# EAGLE design untitled (EAGLE 9.6.1)
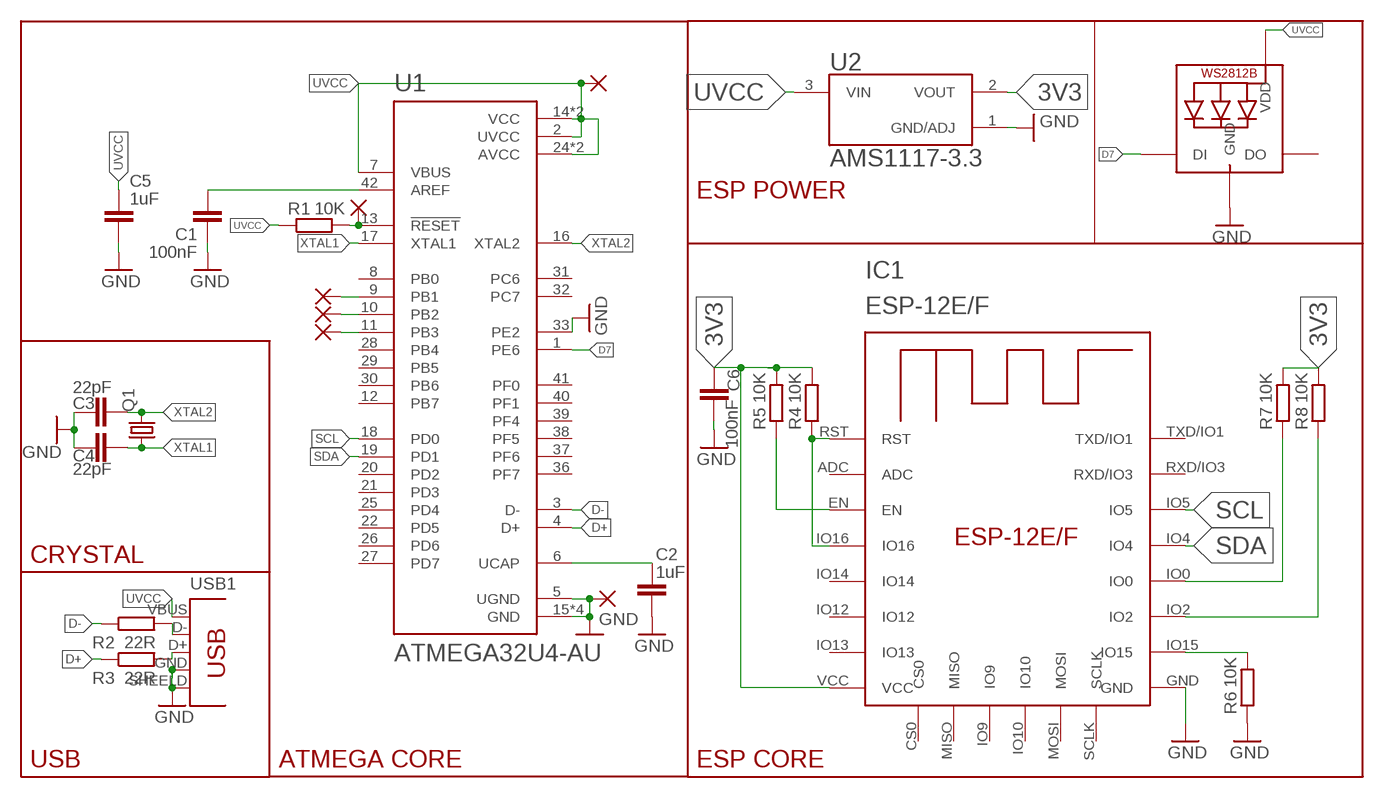
[diagram p0: schematic, sheet 1]

## Parts
C1  100nF  C-EUC0805  [C0805]
C2  1uF  C-EUC0805  [C0805]
C3  22pF  C-EUC0805  [C0805]
C4  22pF  C-EUC0805  [C0805]
C5  1uF  C-EUC0805  [C0805]
C6  100nF  C-EUC0805  [C0805]
IC1  ESP-12E/F  [ESP-12E]
LED1  WS2812B5050  [WS2812B]
PAD1  1,6/0,8  [1,6/0,8]
PAD2  1,6/0,8  [1,6/0,8]
PAD3  1,6/0,8  [1,6/0,8]
PAD4  1,6/0,8  [1,6/0,8]
PAD5  1,6/0,8  [1,6/0,8]
PAD6  1,6/0,8  [1,6/0,8]
Q1  CRYSTALCTS406  [CTS406]
R1  10K  R-EU_R0805  [R0805]
R2  22R  R-EU_R0805  [R0805]
R3  22R  R-EU_R0805  [R0805]
R4  10K  R-EU_R0805  [R0805]
R5  10K  R-EU_R0805  [R0805]
R6  10K  R-EU_R0805  [R0805]
R7  10K  R-EU_R0805  [R0805]
R8  10K  R-EU_R0805  [R0805]
U1  ATMEGA32U4-AU  [QFP80P1200X1200X120-44N]
U2  AMS1117-3.3  [SOT229P700X180-4N]
USB1  TYPE-A-MALE-SHILED  [TYPE-A-MALE]

## Nets
3V3: C6.1 IC1.VCC R4.2 R5.2 R7.2 R8.2 U2.2(VOUT)
D7: LED1.4-DIN(DI) U1.1(PE6)
D+: R3.1 U1.4(D+)
D-: R2.1 U1.3(D-)
GND: C1.1 C2.2 C3.1 C4.1 C5.2 C6.2 IC1.GND LED1.3-GND(GND) PAD6.1(P) R6.1 U1.5(UGND) U1.15(GND) U1.23(GND) U1.33(PE2) U1.35(GND) U1.43(GND) U2.1(GND/ADJ) USB1.GND USB1.SHEELD
MISO: PAD3.1(P) U1.11(PB3)
MOSI: PAD2.1(P) U1.10(PB2)
N$1: R2.2 USB1.D-
N$2: C1.2 U1.42(AREF)
N$3: C2.1 U1.6(UCAP)
N$5: R3.2 USB1.D+
N$6: IC1.IO16 IC1.RST R4.1
N$7: IC1.EN R5.1
N$9: IC1.IO0 R7.1
N$10: IC1.IO2 R8.1
N$12: IC1.IO15 R6.2
RST: PAD4.1(P) R1.2 U1.13(!RESET)
SCK: PAD1.1(P) U1.9(PB1)
SCL: IC1.IO5 U1.18(PD0)
SDA: IC1.IO4 U1.19(PD1)
UVCC: C5.1 LED1.1-VDD(VDD) PAD5.1(P) R1.1 U1.2(UVCC) U1.7(VBUS) U1.14(VCC) U1.24(AVCC) U1.34(VCC) U1.44(AVCC) U2.3(VIN) USB1.VBUS
XTAL1: C4.2 Q1.1 U1.17(XTAL1)
XTAL2: C3.2 Q1.3 U1.16(XTAL2)
Unconnected: IC1.ADC IC1.CS0 IC1.IO9 IC1.IO10 IC1.IO12 IC1.IO13 IC1.IO14 IC1.MISO IC1.MOSI IC1.RXD/IO3 IC1.SCLK IC1.TXD/IO1 LED1.2-DOUT(DO) U1.8(PB0) U1.12(PB7) U1.20(PD2) U1.21(PD3) U1.22(PD5) U1.25(PD4) U1.26(PD6) U1.27(PD7) U1.28(PB4) U1.29(PB5) U1.30(PB6) U1.31(PC6) U1.32(PC7) U1.36(PF7) U1.37(PF6) U1.38(PF5) U1.39(PF4) U1.40(PF1) U1.41(PF0)

## Notes on the sheet
- ESP POWER
- CRYSTAL
- USB | ATMEGA CORE | ESP CORE

## Library data of the parts
C1-C6 = rcl:C-EU: CAPACITOR, European symbol; SPICEPREFIX: C
IC1 = esp-12e-f:ESP-12E/F
LED1 = WS2812B_LED:WS2812B: Check availability <https://pricing.snapeda.com/parts/WS2812B/Worldsemi/view-part?ref=eda>; AVAILABILITY: Not in stock; CHECK_PRICES: https://www.snapeda.com/parts/WS2812B/Worldsemi/view-part/?ref=eda; DESCRIPTION: Intelligent control LED integrated light source; MF: Worldsemi; MP: WS2812B; PACKAGE: None; PRICE: None; SNAPEDA_LINK: https://www.snapeda.com/parts/WS2812B/Worldsemi/view-part/?ref=snap
PAD1-PAD6 = wirepad:1,6/0,8: THROUGH-HOLE PAD
Q1 = crystal:CRYSTAL: CRYSTAL; OC_FARNELL: unknown; OC_NEWARK: unknown
R1-R8 = rcl:R-EU_: RESISTOR, European symbol; SPICEPREFIX: R
U1 = ATMEGA32U4-AU:ATMEGA32U4-AU: ATmega Series 16 MHz 32 KB Flash 2.5 KB SRAM 8-Bit Microcontroller - TQFP-44 Check availability <https://pricing.snapeda.com/parts/ATMEGA32U4-AU/Microchip/view-part?ref=eda>; AVAILABILITY: In Stock; CHECK_PRICES: https://www.snapeda.com/parts/ATMEGA32U4-AU/Microchip/view-part/?ref=eda; DESCRIPTION: Microcontroller, USB controller 16/32K of ISP flash, TQFP44 industrial, 8-bit | Microchip Technology Inc. ATMEGA32U4-AU; MF: Microchip; MP: ATMEGA32U4-AU; PACKAGE: TQFP-44 Microchip; PRICE: None; PURCHASE-URL: https://www.snapeda.com/api/url_track_click_mouser/?unipart_id=50641&manufacturer=Microchip&part_name=ATMEGA32U4-AU&search_term=atmega32u4-au; SNAPEDA_LINK: https://www.snapeda.com/parts/ATMEGA32U4-AU/Microchip/view-part/?ref=snap
U2 = AMS1117-3.3:AMS1117-3.3: Check availability <https://pricing.snapeda.com/parts/AMS1117-3.3/Advanced%20Monolithic%20Systems/view-part?ref=eda>; AVAILABILITY: Not in stock; CHECK_PRICES: https://www.snapeda.com/parts/AMS1117-3.3/Advanced+Monolithic+Systems/view-part/?ref=eda; DESCRIPTION: Sot223/Pkg 1-Amp 3.3-Volt Low Drop Out Voltage Regulatator; MF: Advanced Monolithic Systems; MP: AMS1117-3.3; PACKAGE: SOT-223 Seeed Technology; PRICE: None; SNAPEDA_LINK: https://www.snapeda.com/parts/AMS1117-3.3/Advanced+Monolithic+Systems/view-part/?ref=snap
USB1 = usb-connector:TYPE-A-MALE-SHILED

## Board
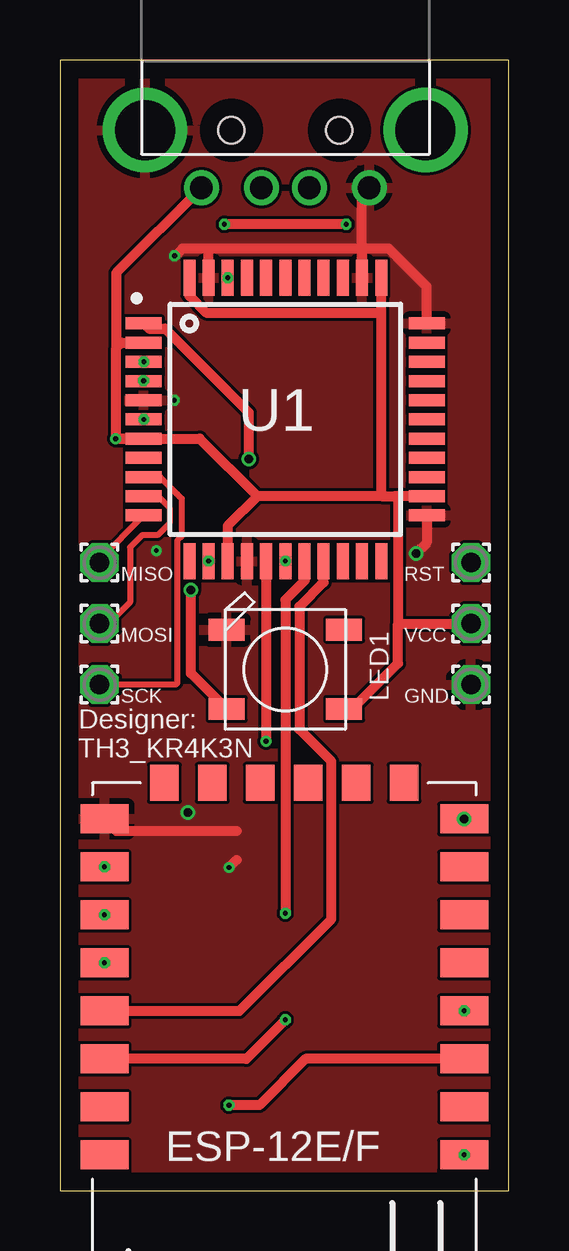
[diagram p1: board, top side]
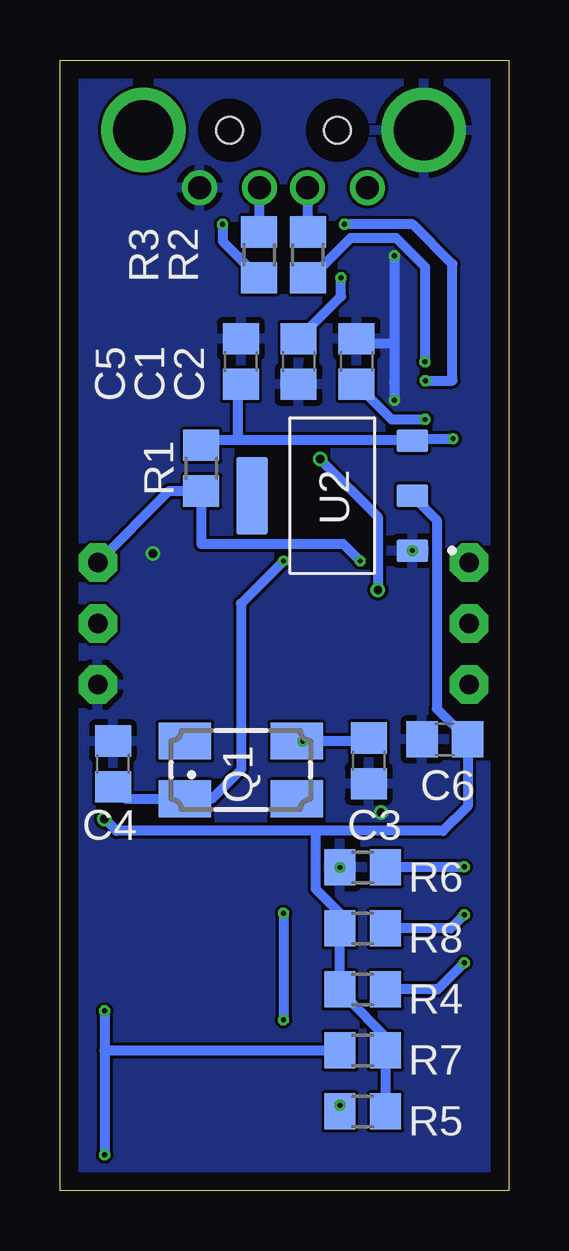
[diagram p2: board, bottom side, seen from below]

Size 18.72 x 47.11 mm. Coordinates in mm from the lower left corner, seen from the top.
Outline: 0,0 18.72,0 18.72,47.11 0,47.11 0,0
Copper layers (1*16): Top 0.035mm / dielectric 1.5mm / Bottom 0.035mm
Design rules "default *": minimum track width 5mil, minimum drill 0.2mm, track to track 5mil, track to pad 5mil, pad to pad 5mil, via to via 5mil, smd to smd 5mil, copper to edge 30mil, drill to drill 5mil, minimum pad ring 10mil, minimum via ring 5mil, stop-mask expansion 4mil, vias tented up to drill 0mil, thermal gap 10mil

### Footprints (pad centres in the part's own frame; a part is rotated, then mirrored left to right if it is on the bottom)
C0805 = smd 1.3 x 1.5: 1 -0.95,0; 2 0.95,0
ESP-12E = smd 2 x 1.2: ADC -7.46,5.53; EN -7.46,3.53; GND 7.54,-6.47; IO0 7.54,-0.47; IO2 7.54,-2.47; IO4 7.54,1.53; IO5 7.54,3.53; IO12 -7.46,-2.47; IO13 -7.46,-4.47; IO14 -7.46,-0.47; IO15 7.54,-4.47; IO16 -7.46,1.53; RST -7.46,7.53; RXD/IO3 7.54,5.53; TXD/IO1 7.54,7.53; VCC -7.46,-6.47 | smd 1.2 x 1.5: CS0 -4.96,-7.97; IO9 -0.96,-7.97; IO10 1.04,-7.97; MISO -2.96,-7.97; MOSI 3.04,-7.97; SCLK 5.04,-7.97
WS2812B = smd 1.5 x 0.9: 1-VDD 2.45,-1.65; 2-DOUT 2.45,1.65; 3-GND -2.45,1.65; 4-DIN -2.45,-1.65
1,6/0,8 = drill 0.813 pad 1.6 octagon: 1 0,0
CTS406 = smd 2.184 x 1.524: 1 -2.327,-1.2; 2 2.327,-1.2; 3 2.327,1.2; 4 -2.327,1.2
R0805 = smd 1.3 x 1.5: 1 -0.95,0; 2 0.95,0
QFP80P1200X1200X120-44N = smd 1.5 x 0.5: 1 -5.9,4; 2 -5.9,3.2; 3 -5.9,2.4; 4 -5.9,1.6; 5 -5.9,0.8; 6 -5.9,0; 7 -5.9,-0.8; 8 -5.9,-1.6; 9 -5.9,-2.4; 10 -5.9,-3.2; 11 -5.9,-4; 23 5.9,-4; 24 5.9,-3.2; 25 5.9,-2.4; 26 5.9,-1.6; 27 5.9,-0.8; 28 5.9,0; 29 5.9,0.8; 30 5.9,1.6; 31 5.9,2.4; 32 5.9,3.2; 33 5.9,4 | smd 0.5 x 1.5: 12 -4,-5.9; 13 -3.2,-5.9; 14 -2.4,-5.9; 15 -1.6,-5.9; 16 -0.8,-5.9; 17 0,-5.9; 18 0.8,-5.9; 19 1.6,-5.9; 20 2.4,-5.9; 21 3.2,-5.9; 22 4,-5.9; 34 4,5.9; 35 3.2,5.9; 36 2.4,5.9; 37 1.6,5.9; 38 0.8,5.9; 39 0,5.9; 40 -0.8,5.9; 41 -1.6,5.9; 42 -2.4,5.9; 43 -3.2,5.9; 44 -4,5.9
SOT229P700X180-4N = smd 1.31 x 0.93: 1 -3.345,2.29; 2 -3.345,0; 3 -3.345,-2.29 | smd 1.31 x 3.24: 4 3.345,0
TYPE-A-MALE = drill 0.95: D+ 1,0; D- -1,0; GND 3.5,0; VBUS -3.5,0 | drill 2.5: SHEELD -5.85,2.4; SHEELD2 5.85,2.4 | hole 1.1: -2.25,2.4; 2.25,2.4

### Placement (x,y rotation side)
C1  8.76,34.54 90 bottom
C2  6.35,34.54 90 bottom
C3  5.84,17.91 90 bottom
C4  16.51,17.78 270 bottom
C5  11.18,34.54 90 bottom
C6  2.67,18.8 180 bottom
IC1  9.4,9.02 180 top
LED1  9.4,21.72 0 top
PAD1  1.65,21.08 180 top
PAD2  1.65,23.62 180 top
PAD3  1.65,26.16 180 top
PAD4  17.14,26.16 0 top
PAD5  17.14,23.62 0 top
PAD6  17.14,21.08 0 top
Q1  11.18,17.53 0 bottom
R1  12.83,30.1 270 bottom
R2  8.38,38.99 90 bottom
R3  10.41,38.99 90 bottom
R4  6.1,5.84 0 bottom
R5  6.1,3.3 0 bottom
R6  6.1,13.46 0 bottom
R7  6.1,8.38 180 bottom
R8  6.1,10.92 180 bottom
U1  9.4,32.13 0 top
U2  7.37,28.96 180 bottom
USB1  9.4,41.78 0 top

### Tracks (layer width: path | path; a pad name or v marks a point on that pad's centre or on a via)
3V3  (via drill 0.35)
  Bottom 0.406: U2.2 3,27.94 3,20.08 C6.1 1.72,16.02 2.75,14.99 8.13,14.99 | 8.13,14.99 16.36,14.99 IC1.VCC | R5.2 R4.2 5.08,5.84 4.83,6.1 7.05,8.32 R7.2 R8.2 7.05,11.56 8.05,12.56 8.05,14.91 8.13,14.99
  other vias: 16.86,15.49
D7  (via drill 0.35)
  Top 0.406: U1.1 3.72,35.91 4.38,35.91 7.87,32.42 v7.87,30.48 | LED1.4-DIN 5.46,21.55 v5.46,25.02
  Bottom 0.406: v7.87,30.48 5.46,28.07 v5.46,25.02
D+  (via drill 0.2)
  Top 0.406: U1.4 v3.49,33.74 | v11.94,40.26 v6.86,40.26
  Bottom 0.406: v3.49,33.74 2.35,33.74 2.35,38.6 4,40.26 v6.86,40.26 | R3.1 11.31,38.93 11.94,39.56 v11.94,40.26
D-  (via drill 0.2)
  Bottom 0.406: R2.1 8.25,38.04 6.59,39.7 4.71,39.7 3.5,38.49 U1.3
  other vias: 3.5,34.53
GND  (via drill 0.2, 0.35)
  Top 0.406: U1.33 15.3,37.66 13.72,39.24 12.7,39.24 | 12.7,39.24 12.6,39.14 U1.35 12.6,41.48 USB1.GND | 7.37,14.99 2.36,14.99 IC1.GND | R6.1 7.37,13.78 | 12.7,39.24 6.22,39.24 | 6.22,39.24 5.11,39.24 4.79,38.93 v4.78,38.95 | U1.43 6.2,39.22 6.22,39.24 | U1.23 15.3,27 v14.85,26.55
  Bottom 0.406: 8.25,33.59 C1.1 | 10.67,35.49 C5.2 | v4.78,38.95 4.78,35.31 | 4.78,35.31 4.78,33.7 4.77,33.69 v4.77,32.93 | C2.2 6.16,35.31 4.78,35.31 | 5.46,16.96 C3.1
  other vias: 4.02,26.67 7.05,13.46 5.33,15.75
  pour Bottom: 0,0 0,46.99 18.67,46.99 18.67,0
  pour Top: 0,0 0,46.99 18.67,46.99 18.67,0
MISO
  Top 0.254: U1.11 1.65,26.28 PAD3.1
MOSI
  Top 0.254: U1.10 4.09,28.93 4.57,28.45 4.57,27.81 4.06,27.3 3.43,27.3 2.92,26.8 2.92,24.51 2.03,23.62 PAD2.1
N$1
  Bottom 0.406: USB1.D- 8.4,39.95 R2.2
N$2  (via drill 0.2)
  Bottom 0.406: C1.2 7,37.26 U1.42
  other vias: 7,38.03
N$3  (via drill 0.2)
  Bottom 0.406: C2.1 4.89,32.13 U1.6
  other vias: 3.5,32.13
N$5
  Bottom 0.406: USB1.D+ 10.41,41.77 R3.2
N$6  (via drill 0.2)
  Bottom 0.406: 16.86,5.84 R4.1 | IC1.IO16 16.86,5.84 | 16.86,5.84 IC1.RST
  other vias: 16.86,7.49 16.86,1.49
N$7  (via drill 0.2)
  Top 0.406: IC1.EN 10.25,5.49 8.32,3.56 v7.05,3.56
  Bottom 0.406: R5.1 v7.05,3.56
N$9  (via drill 0.2)
  Bottom 0.406: IC1.IO0 2.96,8.38 R7.1
  other vias: 1.86,9.49
N$10  (via drill 0.2)
  Bottom 0.406: IC1.IO2 2.42,10.92 R8.1
  other vias: 1.86,11.49
N$12  (via drill 0.2)
  Bottom 0.406: IC1.IO15 1.88,13.46 R6.2
  other vias: 1.86,13.49
RST  (via drill 0.2)
  Bottom 0.406: U1.13 6.91,26.94 12.83,26.94 R1.2 14.16,29.15 PAD4.1
  other vias: 6.2,26.23
SCK
  Top 0.254: U1.9 4.18,29.73 4.89,29.02 5.08,28.83 5.08,27.27 4.89,27.09 4.89,21.15 4.83,21.08 PAD1.1
SCL  (via drill 0.2)
  Top 0.406: U1.18 10.2,25.41 9.4,24.61 v9.4,11.56 | v9.4,7.11 7.77,5.49 IC1.IO5
  Bottom 0.406: v9.4,11.56 v9.4,7.11
SDA
  Top 0.406: IC1.IO4 7.49,7.49 11.31,11.31 11.31,17.88 9.98,19.22 9.98,24.33 11,25.34 U1.19
UVCC  (via drill 0.2)
  Top 0.406: v2.32,31.33 2.35,31.36 2.35,35.12 | 2.35,35.12 2.56,35.33 | USB1.VBUS 2.35,38.23 2.35,35.31 | 2.35,35.31 2.35,35.12 | 13.4,28.93 8.23,28.93 | U1.14 7,27.7 8.23,28.93 | U1.24 13.97,28.93 | 13.4,28.93 13.97,28.93 | 13.4,28.93 13.4,36.58 | 13.4,36.58 U1.34 | U1.44 5.4,37.27 6.1,36.58 13.4,36.58 | U1.2 3.47,35.31 2.35,35.31 | 8.23,28.93 5.83,31.33 v2.32,31.33 | U1.7 v2.32,31.33 | 13.97,28.93 14.1,28.8 14.1,23.62 | 14.1,23.62 14.1,21.97 12.19,20.07 LED1.1-VDD | 14.1,23.62 PAD5.1
  Bottom 0.406: 3.56,31.29 3.6,31.25 U2.3 4.07,31.29 | 11.31,31.29 4.07,31.29 | R1.1 12.58,31.29 11.31,31.29 | C5.1 11.31,33.46 11.31,31.29 | 4.07,31.29 3.56,31.29 | 3.56,31.29 3.52,31.33 v2.32,31.33
XTAL1  (via drill 0.2)
  Bottom 0.406: U1.17 11.18,24.45 11.18,17.53 12.38,16.33 Q1.1 16.01,16.33 C4.2
  other vias: 9.4,26.23
XTAL2  (via drill 0.2)
  Top 0.406: U1.16 v8.6,18.73
  Bottom 0.406: C3.2 5.97,18.73 v8.6,18.73 Q1.3

### Text on the board
tPlace: MISO | RST | MOSI | VCC | SCK | GND
tNames: Designer: / TH3_KR4K3N